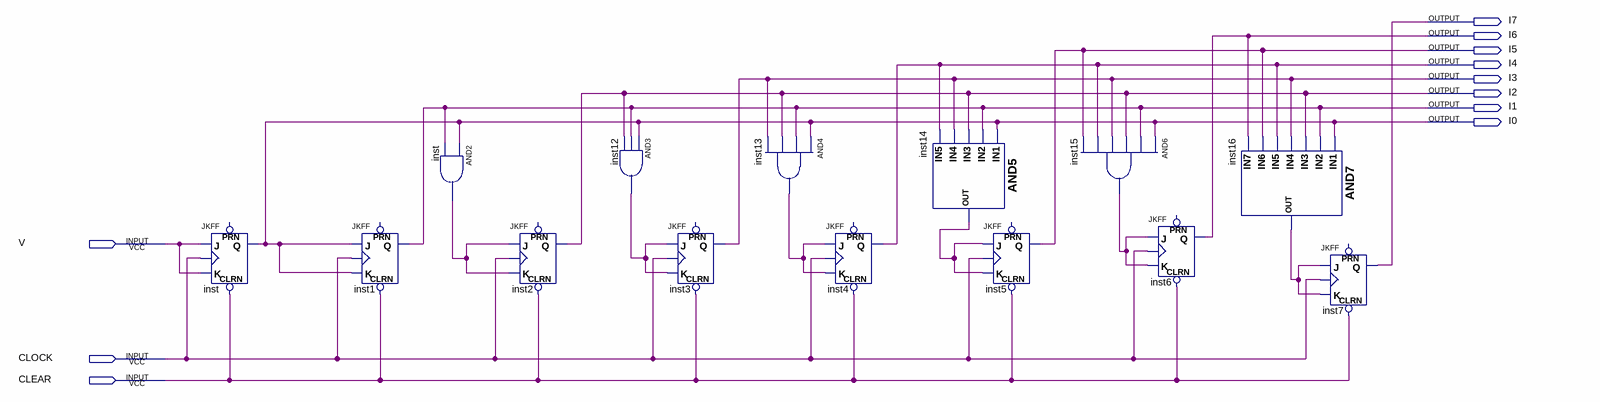
[diagram p0: schematic sheet]
// Quartus schematic 8b_syn_counter_2.bdf as structural Verilog: 14 symbols, 11 pins
module \8b_syn_counter_2  (
  input  V,
  input  CLOCK,
  input  CLEAR,
  output I7,
  output I6,
  output I5,
  output I4,
  output I3,
  output I2,
  output I1,
  output I0
);

  wire inst12_out, inst13_out, inst14_out, inst15_out, inst16_out, inst_out;

  JKFF inst (.CLRN(CLEAR), .K(V), .J(V), .CLK(CLOCK), .Q(I0));  // open: PRN
  JKFF inst1 (.CLRN(CLEAR), .K(I0), .J(I0), .CLK(CLOCK), .Q(I1));  // open: PRN
  and inst_dup2 (inst_out, I0, I1);
  JKFF inst2 (.CLRN(CLEAR), .K(inst_out), .J(inst_out), .CLK(CLOCK), .Q(I2));  // open: PRN
  and inst12 (inst12_out, I0, I1, I2);
  JKFF inst3 (.CLRN(CLEAR), .K(inst12_out), .J(inst12_out), .CLK(CLOCK), .Q(I3));  // open: PRN
  and inst13 (inst13_out, I0, I1, I2, I3);
  JKFF inst4 (.CLRN(CLEAR), .K(inst13_out), .J(inst13_out), .CLK(CLOCK), .Q(I4));  // open: PRN
  and inst14 (inst14_out, I0, I1, I2, I3, I4);
  JKFF inst5 (.CLRN(CLEAR), .K(inst14_out), .J(inst14_out), .CLK(CLOCK), .Q(I5));  // open: PRN
  and inst15 (inst15_out, I0, I1, I2, I3, I4, I5);
  JKFF inst6 (.CLRN(CLEAR), .K(inst15_out), .J(inst15_out), .CLK(CLOCK), .Q(I6));  // open: PRN
  and inst16 (inst16_out, I0, I1, I2, I3, I4, I5, I6);
  JKFF inst7 (.CLRN(CLEAR), .K(inst16_out), .J(inst16_out), .CLK(CLOCK), .Q(I7));  // open: PRN
endmodule
